# Altium schematic sheet Filtros.SchDoc
size A4; DocumentNumber: 4; SheetNumber: 4; SheetTotal: 5
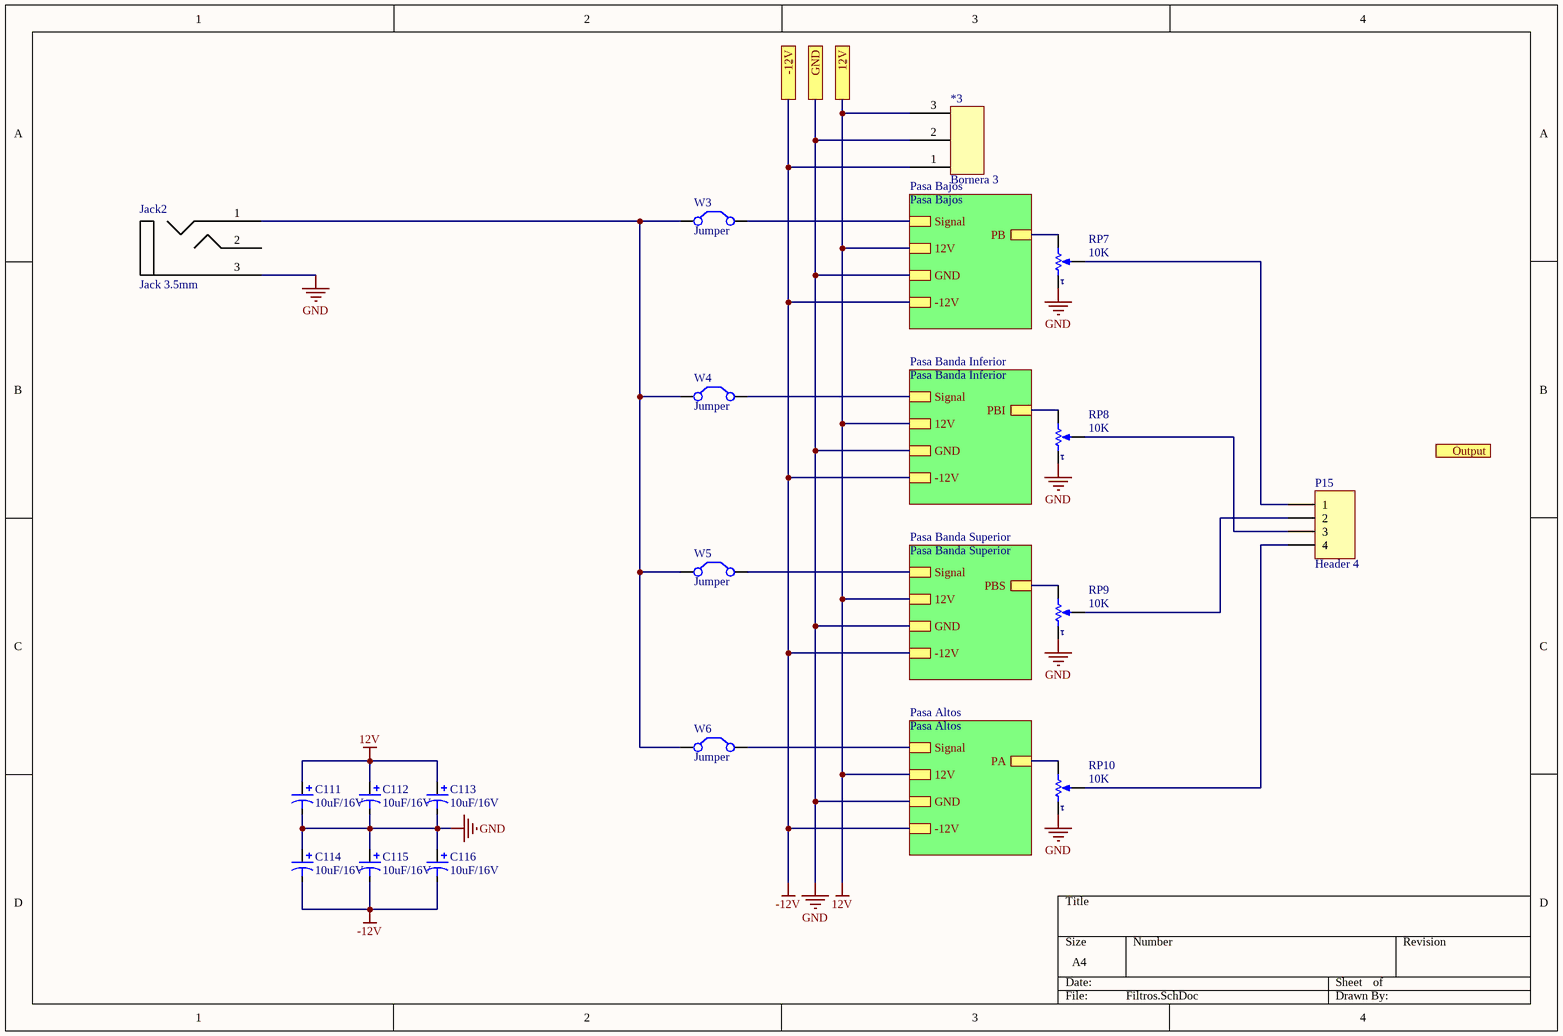
[diagram p0: Filtros.SchDoc]

## Parts
*3  Bornera 3  [bornera 3]
C111  VALOR: 10uF/16V  [CAPR D250 H600 R100 mil]  (hidden comment: Cap Electrolitico Radial)
C112  VALOR: 10uF/16V  [CAPR D250 H600 R100 mil]  (hidden comment: Cap Electrolitico Radial)
C113  VALOR: 10uF/16V  [CAPR D250 H600 R100 mil]  (hidden comment: Cap Electrolitico Radial)
C114  VALOR: 10uF/16V  [CAPR D250 H600 R100 mil]  (hidden comment: Cap Electrolitico Radial)
C115  VALOR: 10uF/16V  [CAPR D250 H600 R100 mil]  (hidden comment: Cap Electrolitico Radial)
C116  VALOR: 10uF/16V  [CAPR D250 H600 R100 mil]  (hidden comment: Cap Electrolitico Radial)
Jack2  Jack 3.5mm  [jack 3.5mm]
P15  Header 4  [Bornera 4]
RP7  VALOR: 10K  [Trimpot Multivuelta Vertical]  (hidden comment: Trimpot)
RP8  VALOR: 10K  [Trimpot Multivuelta Vertical]  (hidden comment: Trimpot)
RP9  VALOR: 10K  [Trimpot Multivuelta Vertical]  (hidden comment: Trimpot)
RP10  VALOR: 10K  [Trimpot Multivuelta Vertical]  (hidden comment: Trimpot)
W3  Jumper  [RAD-0.2]
W4  Jumper  [RAD-0.2]
W5  Jumper  [RAD-0.2]
W6  Jumper  [RAD-0.2]

## Sub-sheets
Pasa Altos = Pasa Altos: Signal, PA, -12V, GND, 12V
Pasa Bajos = Pasa Bajos: Signal, 12V, PB, GND, -12V
Pasa Banda Inferior = Pasa Banda Inferior: Signal, PBI, 12V, GND, -12V
Pasa Banda Superior = Pasa Banda Superior: Signal, PBS, -12V, GND, 12V

## Ports
12V, -12V, GND, Output

## Nets
12V: *3.3(L) C111.1 C112.1 C113.1 ; port 12V, sheet Pasa Bajos/12V, sheet Pasa Altos/12V, sheet Pasa Banda Inferior/12V, sheet Pasa Banda Superior/12V
-12V: *3.1(L) C114.2 C115.2 C116.2 ; port -12V, sheet Pasa Bajos/-12V, sheet Pasa Altos/-12V, sheet Pasa Banda Inferior/-12V, sheet Pasa Banda Superior/-12V
GND: *3.2(L) C111.2 C112.2 C113.2 C114.1 C115.1 C116.1 Jack2.3(Gnd) RP7.1(TOP) RP8.1(TOP) RP9.1(TOP) RP10.1(TOP) ; port GND, sheet Pasa Bajos/GND, sheet Pasa Altos/GND, sheet Pasa Banda Inferior/GND, sheet Pasa Banda Superior/GND
NetJack2_1: Jack2.1(R) W3.1(C1) W4.1(C1) W5.1(C1) W6.1(C1)
NetP15_1: P15.1 RP7.3(TAP)
NetP15_2: P15.2 RP9.3(TAP)
NetP15_3: P15.3 RP8.3(TAP)
NetP15_4: P15.4 RP10.3(TAP)
NetRP7_2: RP7.2(BOT) ; sheet Pasa Bajos/PB
NetRP8_2: RP8.2(BOT) ; sheet Pasa Banda Inferior/PBI
NetRP9_2: RP9.2(BOT) ; sheet Pasa Banda Superior/PBS
NetRP10_2: RP10.2(BOT) ; sheet Pasa Altos/PA
NetW3_2: W3.2(C2) ; sheet Pasa Bajos/Signal
NetW4_2: W4.2(C2) ; sheet Pasa Banda Inferior/Signal
NetW5_2: W5.2(C2) ; sheet Pasa Banda Superior/Signal
NetW6_2: W6.2(C2) ; sheet Pasa Altos/Signal

Not connected (* = marked no-connect by the designer): Jack2 2(L)

## Library data of the parts
C111-C116 = Cap Electrolitico Radial: Cap Electrolitico de insercion; CODIGO STI: *; PROVEEDOR: *; FABRICANTE: *; PART NUMBER: *
P15 = Header 4: Header, 4-Pin; LatestRevisionDate: 17-Jul-2002; LatestRevisionNote: Re-released for DXP Platform.; Publisher: Altium Limited
RP7-RP10 = Trimpot: Preset; CODIGO STI: *; PROVEEDOR: *; FABRICANTE: *; PART NUMBER: *
W3-W6 = Jumper: Jumper Wire; Published: 24-Mar-1999; LatestRevisionDate: 17-Jul-2002; LatestRevisionNote: Re-released for DXP Platform.; PackageReference: RAD-0.2; Publisher: Altium Limited; PackageDescription: Radial Cap, Thru-Hole; 2 Leads; 0.2 in Pin Spacing